# EasyEDA schematic SCH_Elektrisch Schema B_2022-11-22.json

## Sheets
1 Elektrisch schema B: TITLE: Linefillower; REV: 1.0; Date: 2022-10-09; Sheet: 1/1; Drawn By: Robbe Malfroot; Company: Hogent
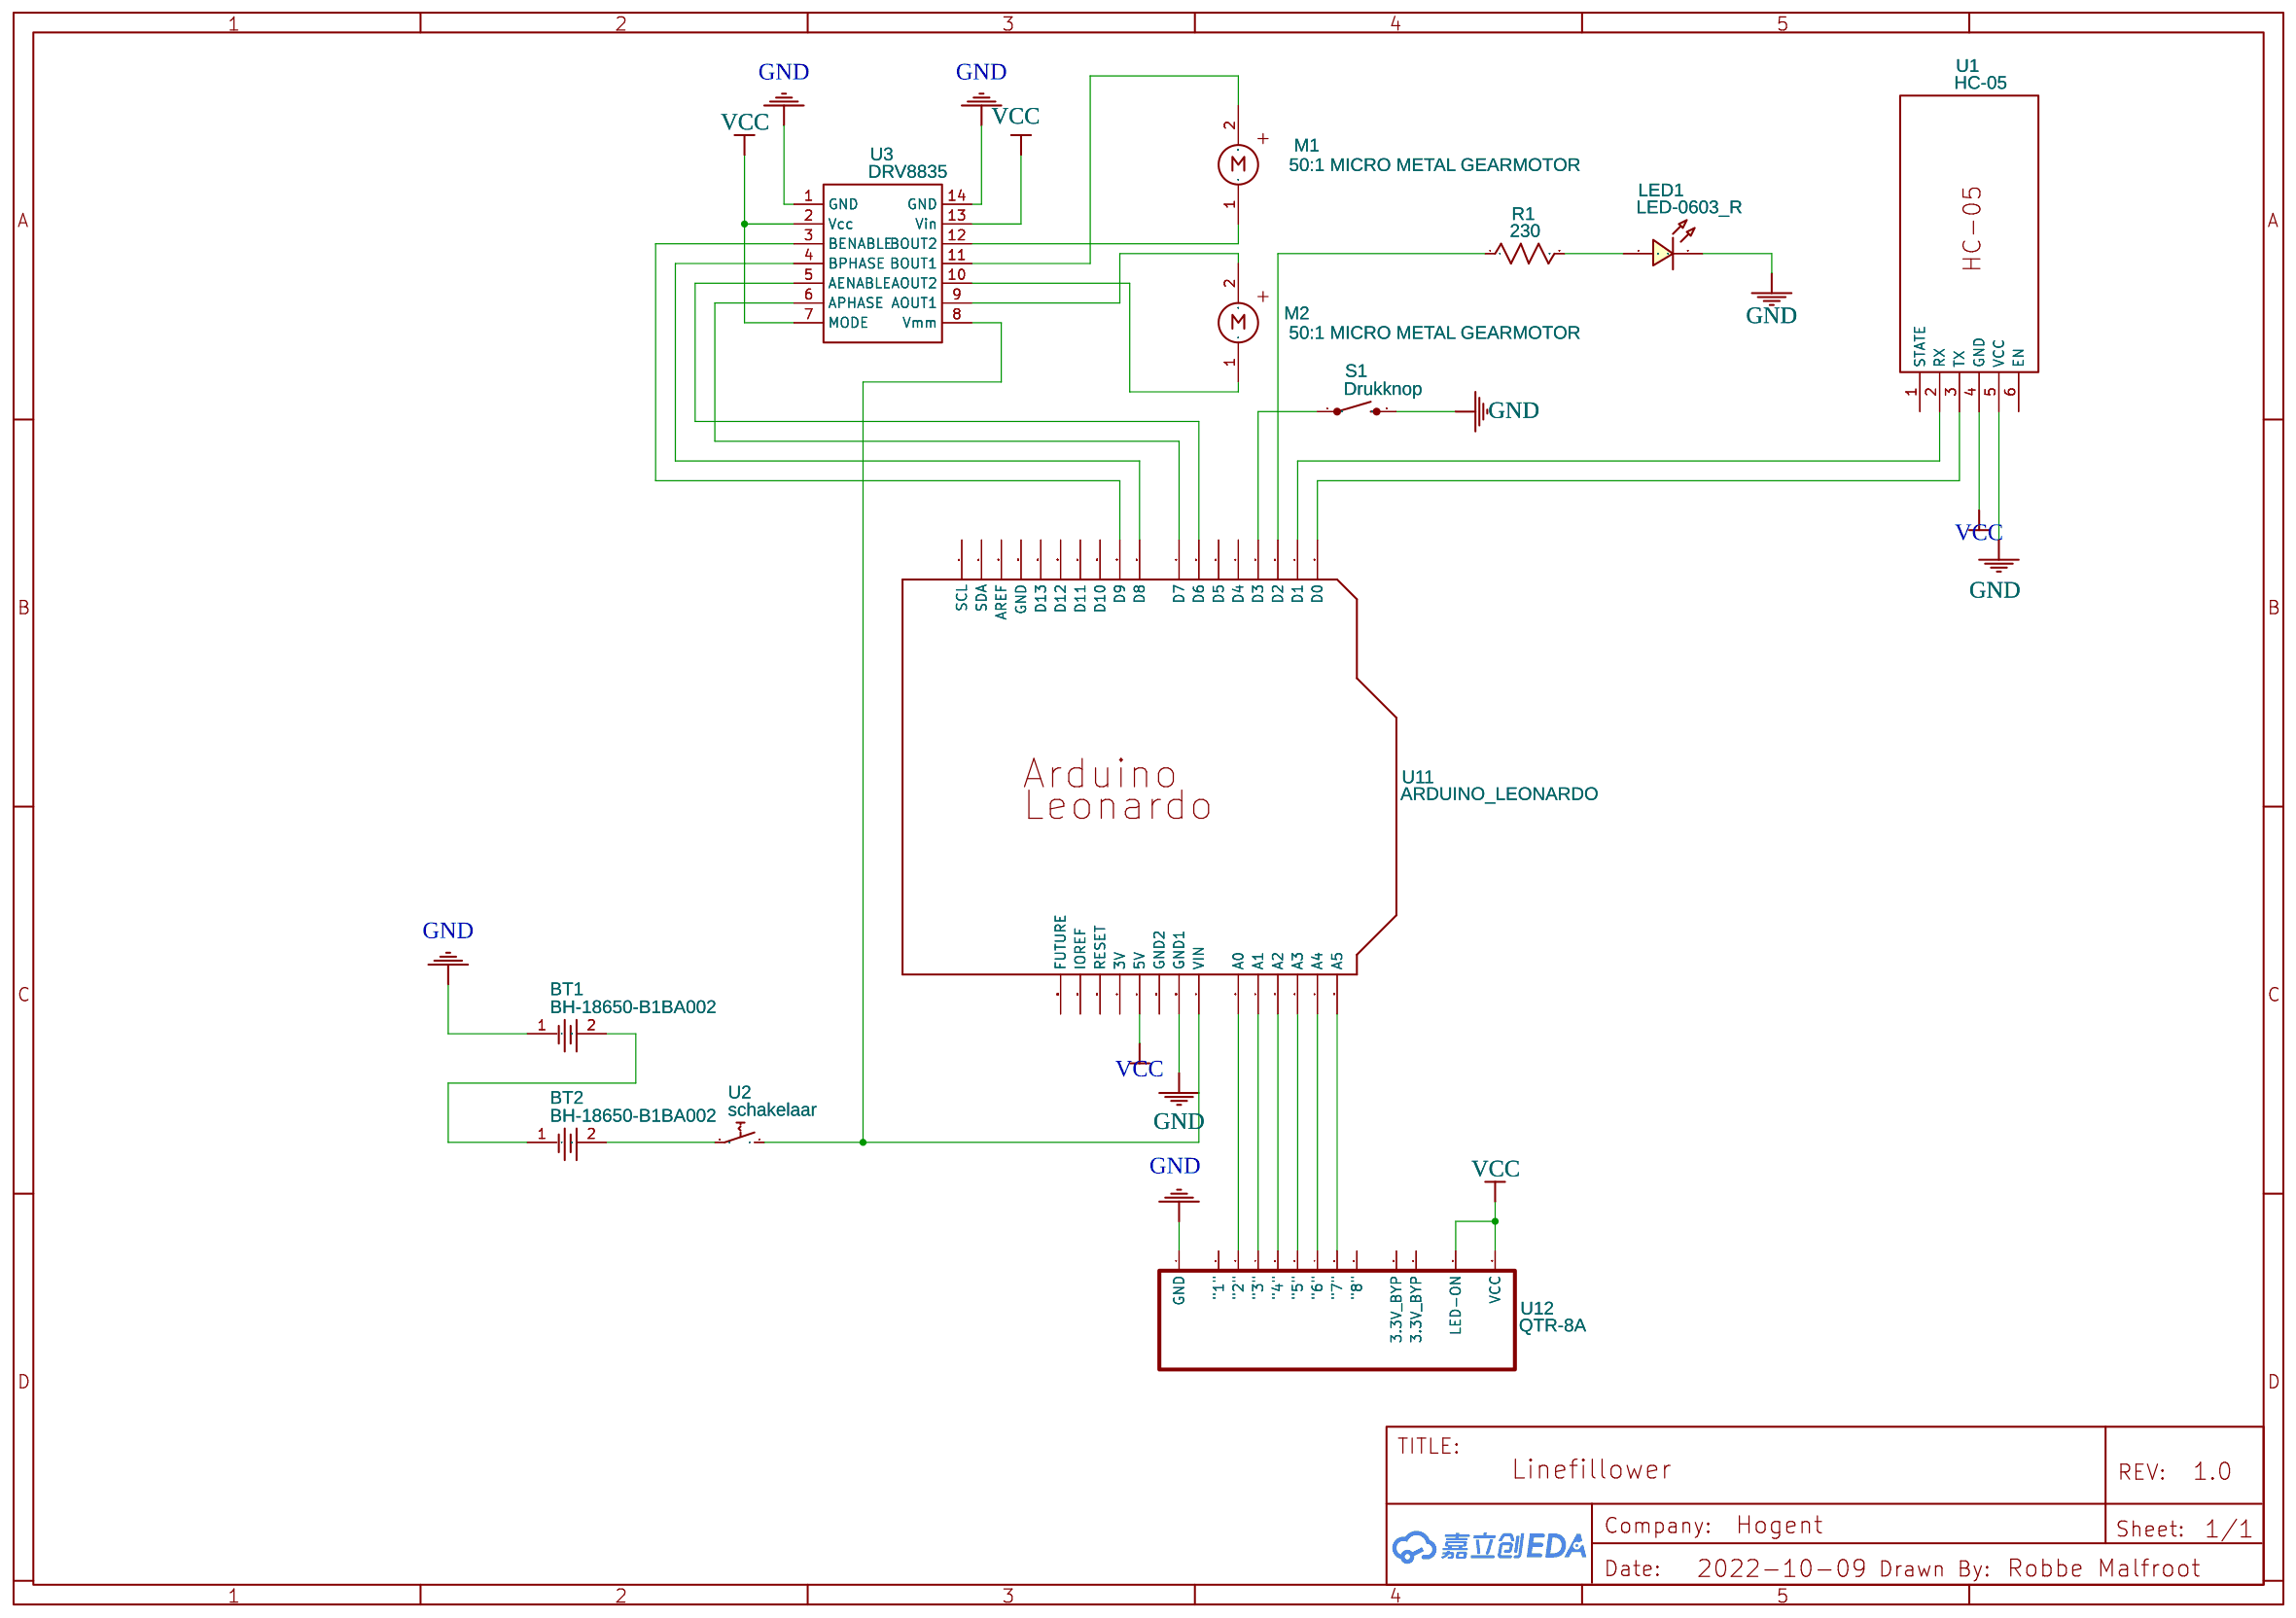
[diagram p0: Elektrisch schema B]
2 Communicatie_HC-05: TITLE: Communicatie HC-05; Date: 2022-10-22
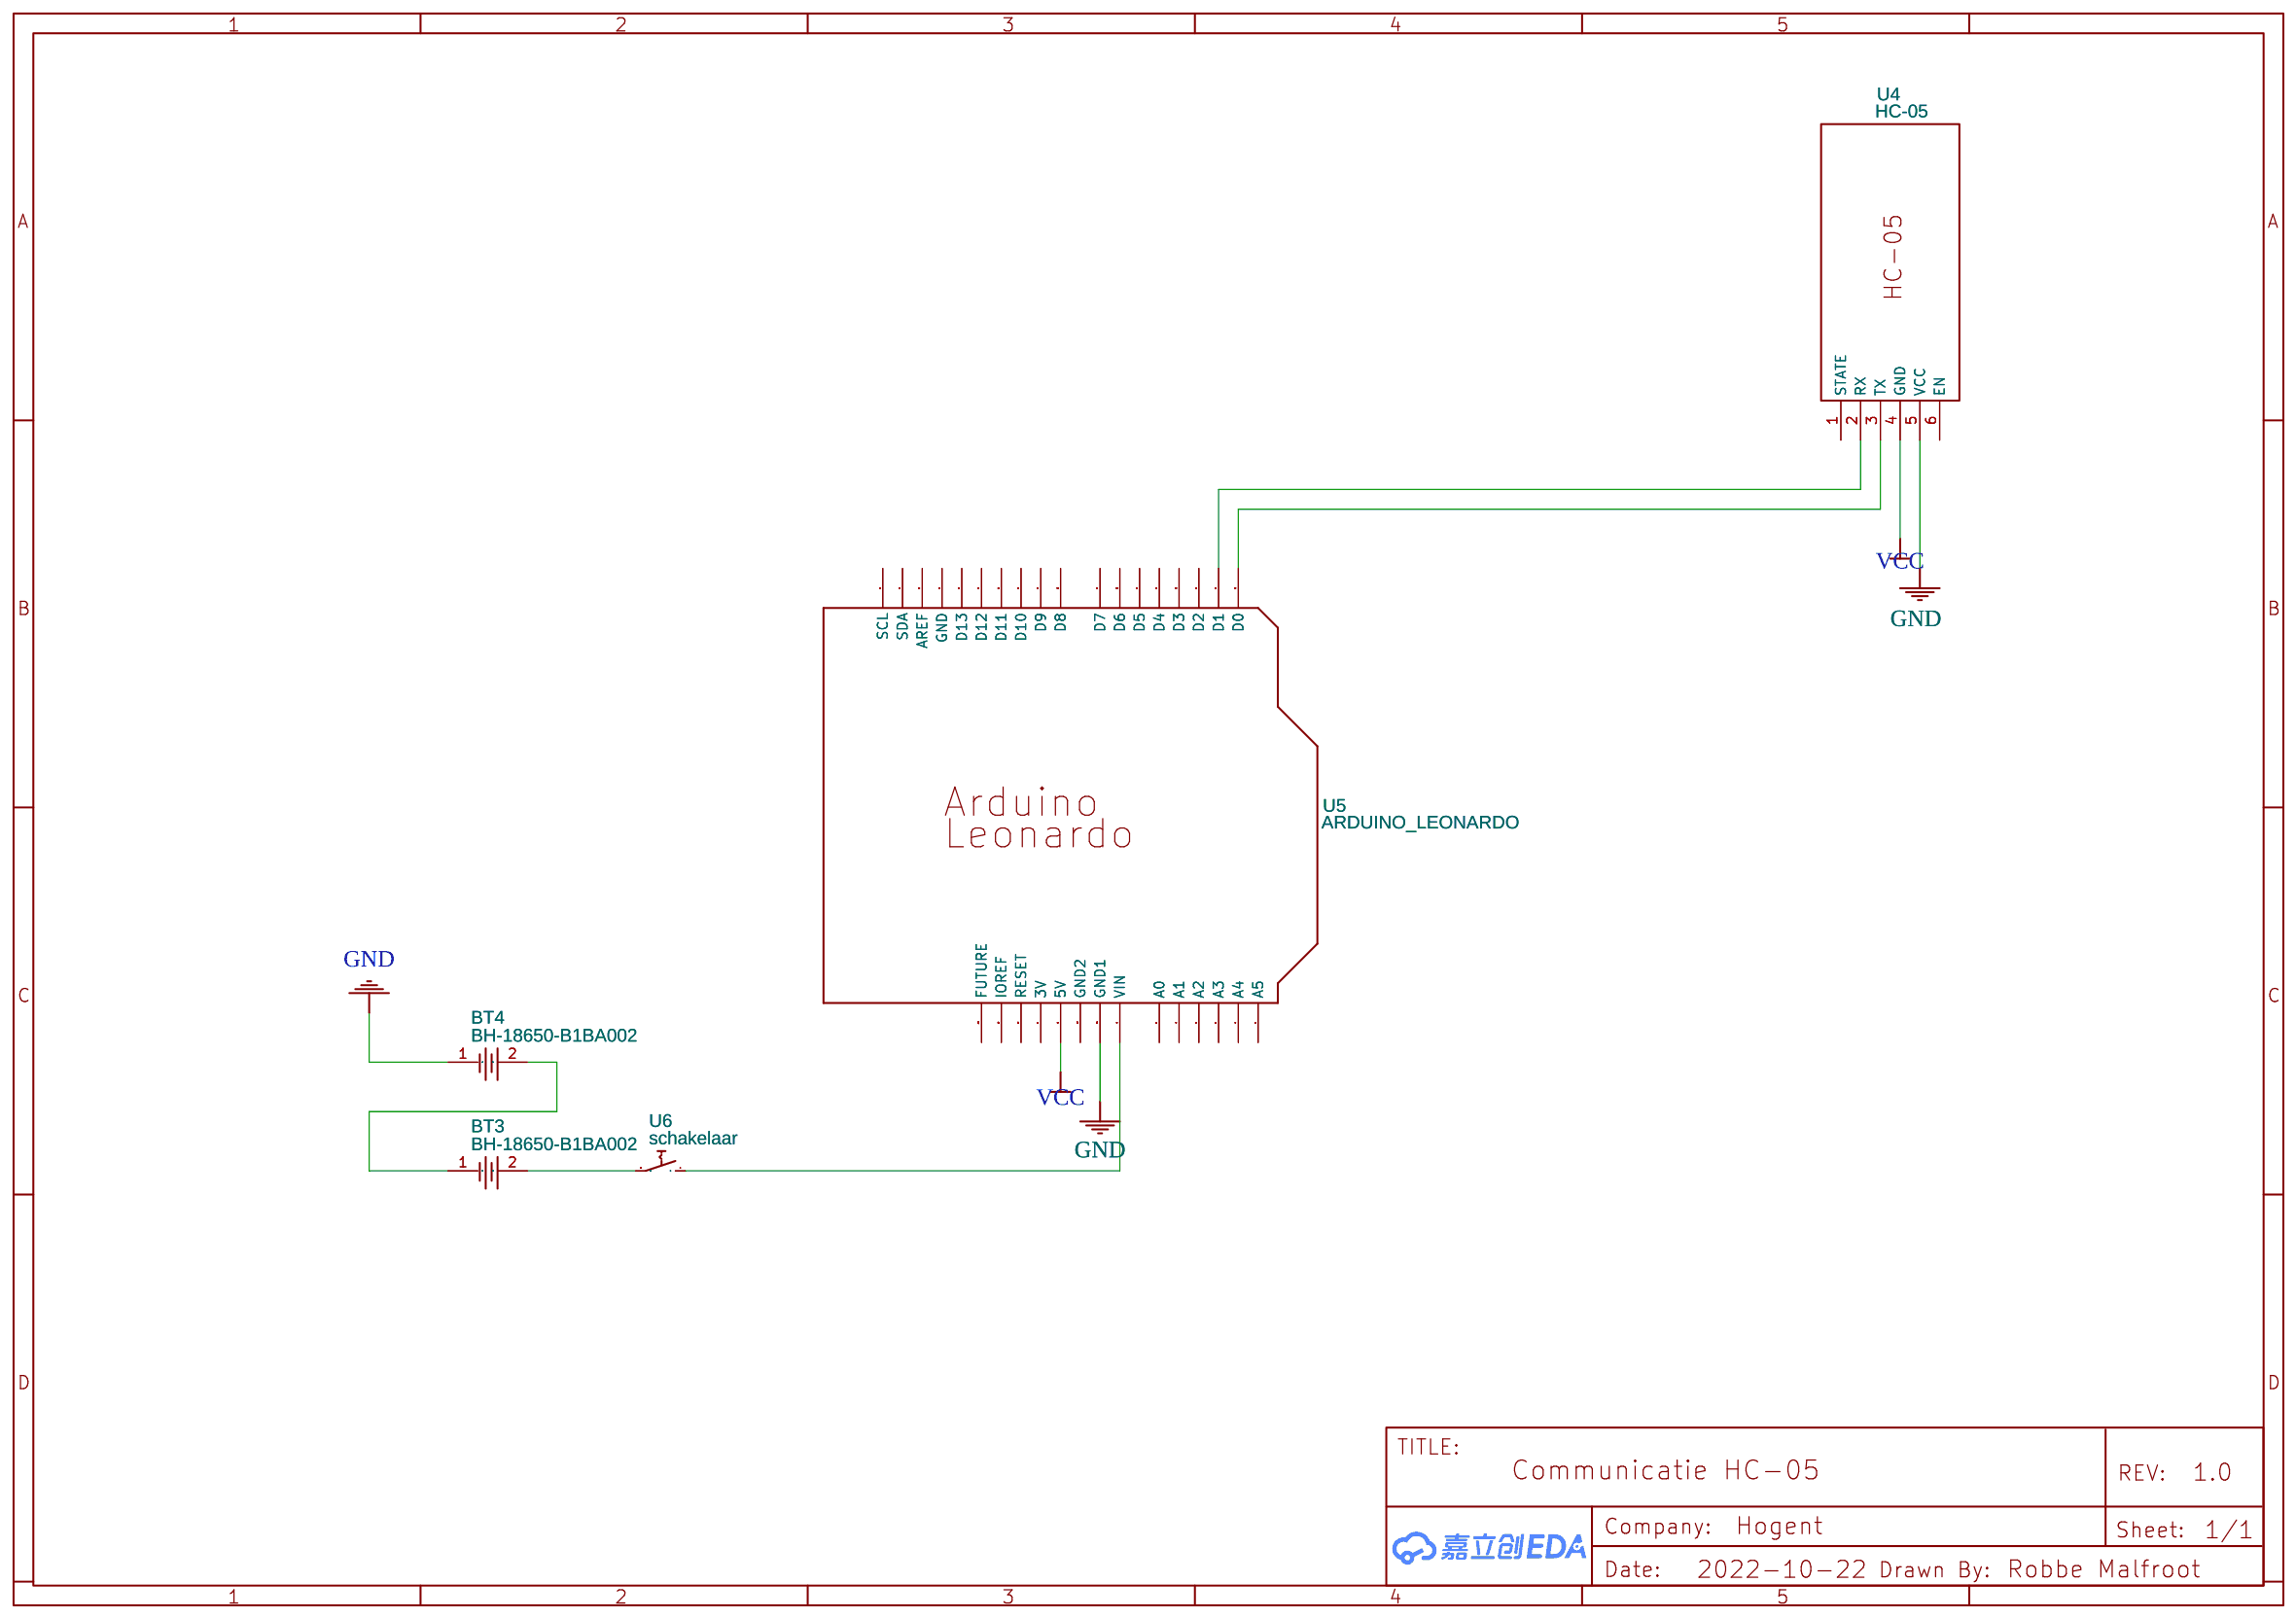
[diagram p1: Communicatie_HC-05]
3 QTR-8A: TITLE: Sensor QTR-8A; Date: 2022-10-22
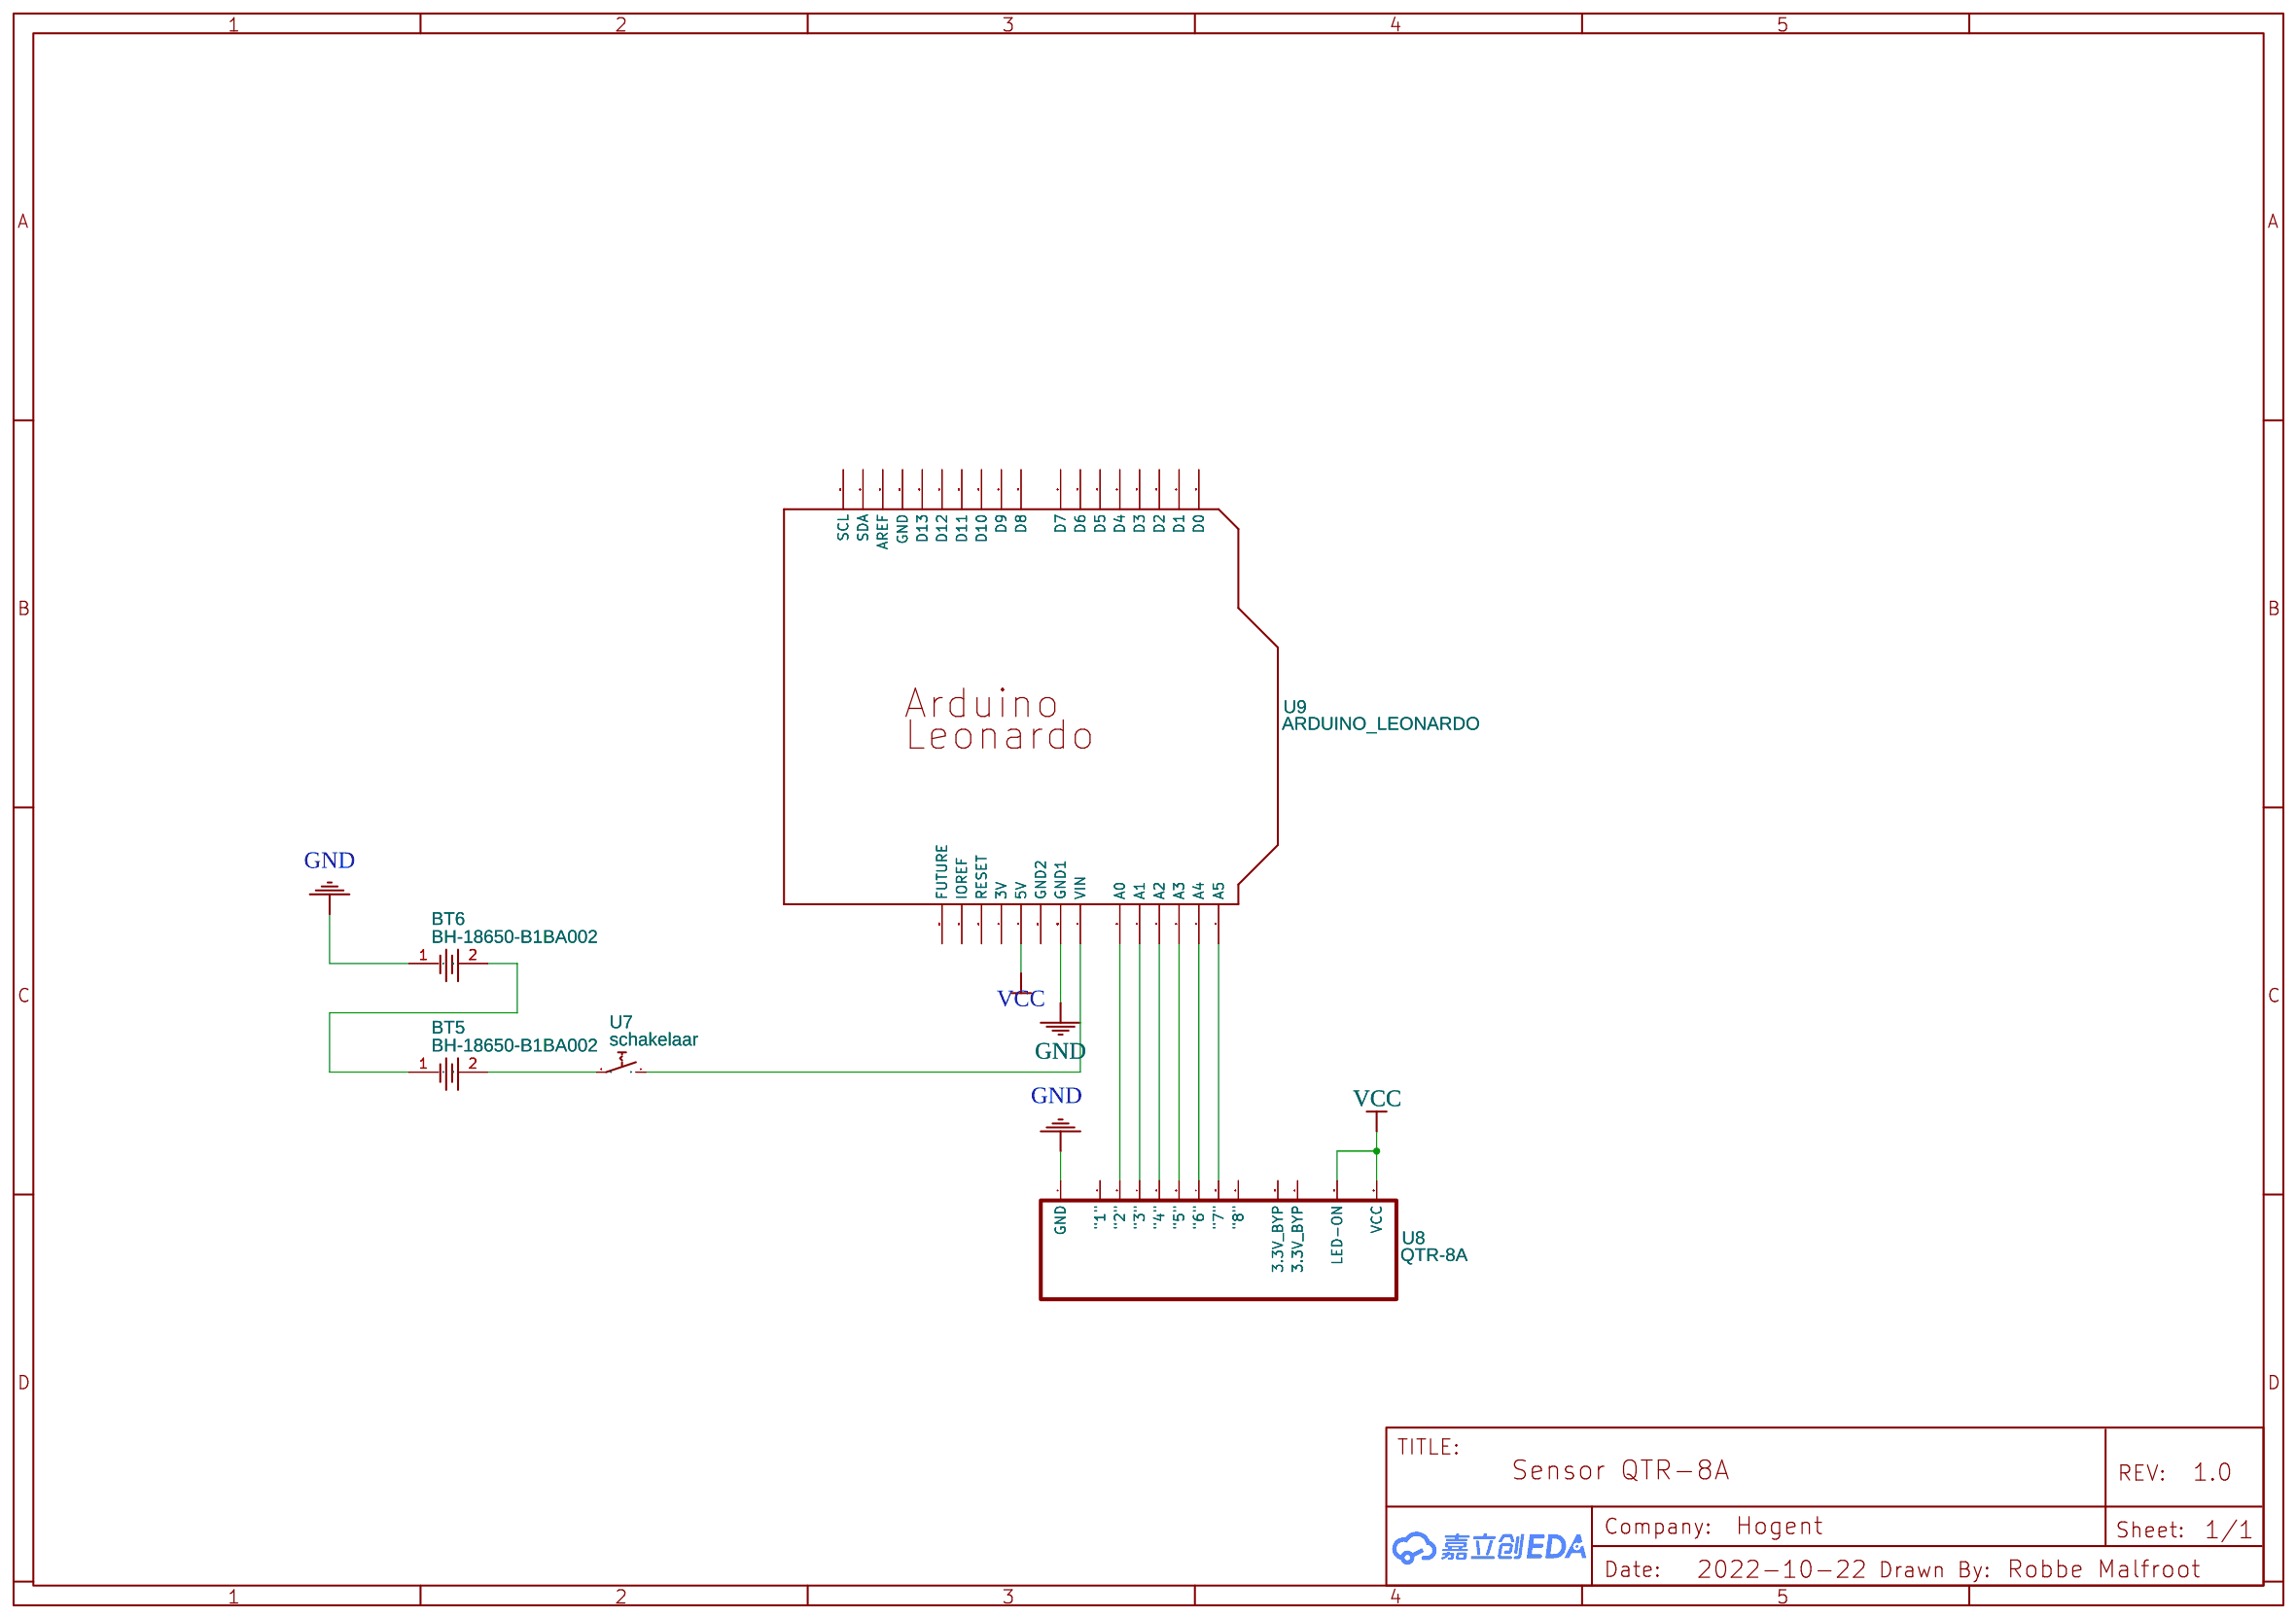
[diagram p2: QTR-8A]
4 H-brug DRV8835: TITLE: H-brug; Date: 2022-10-22
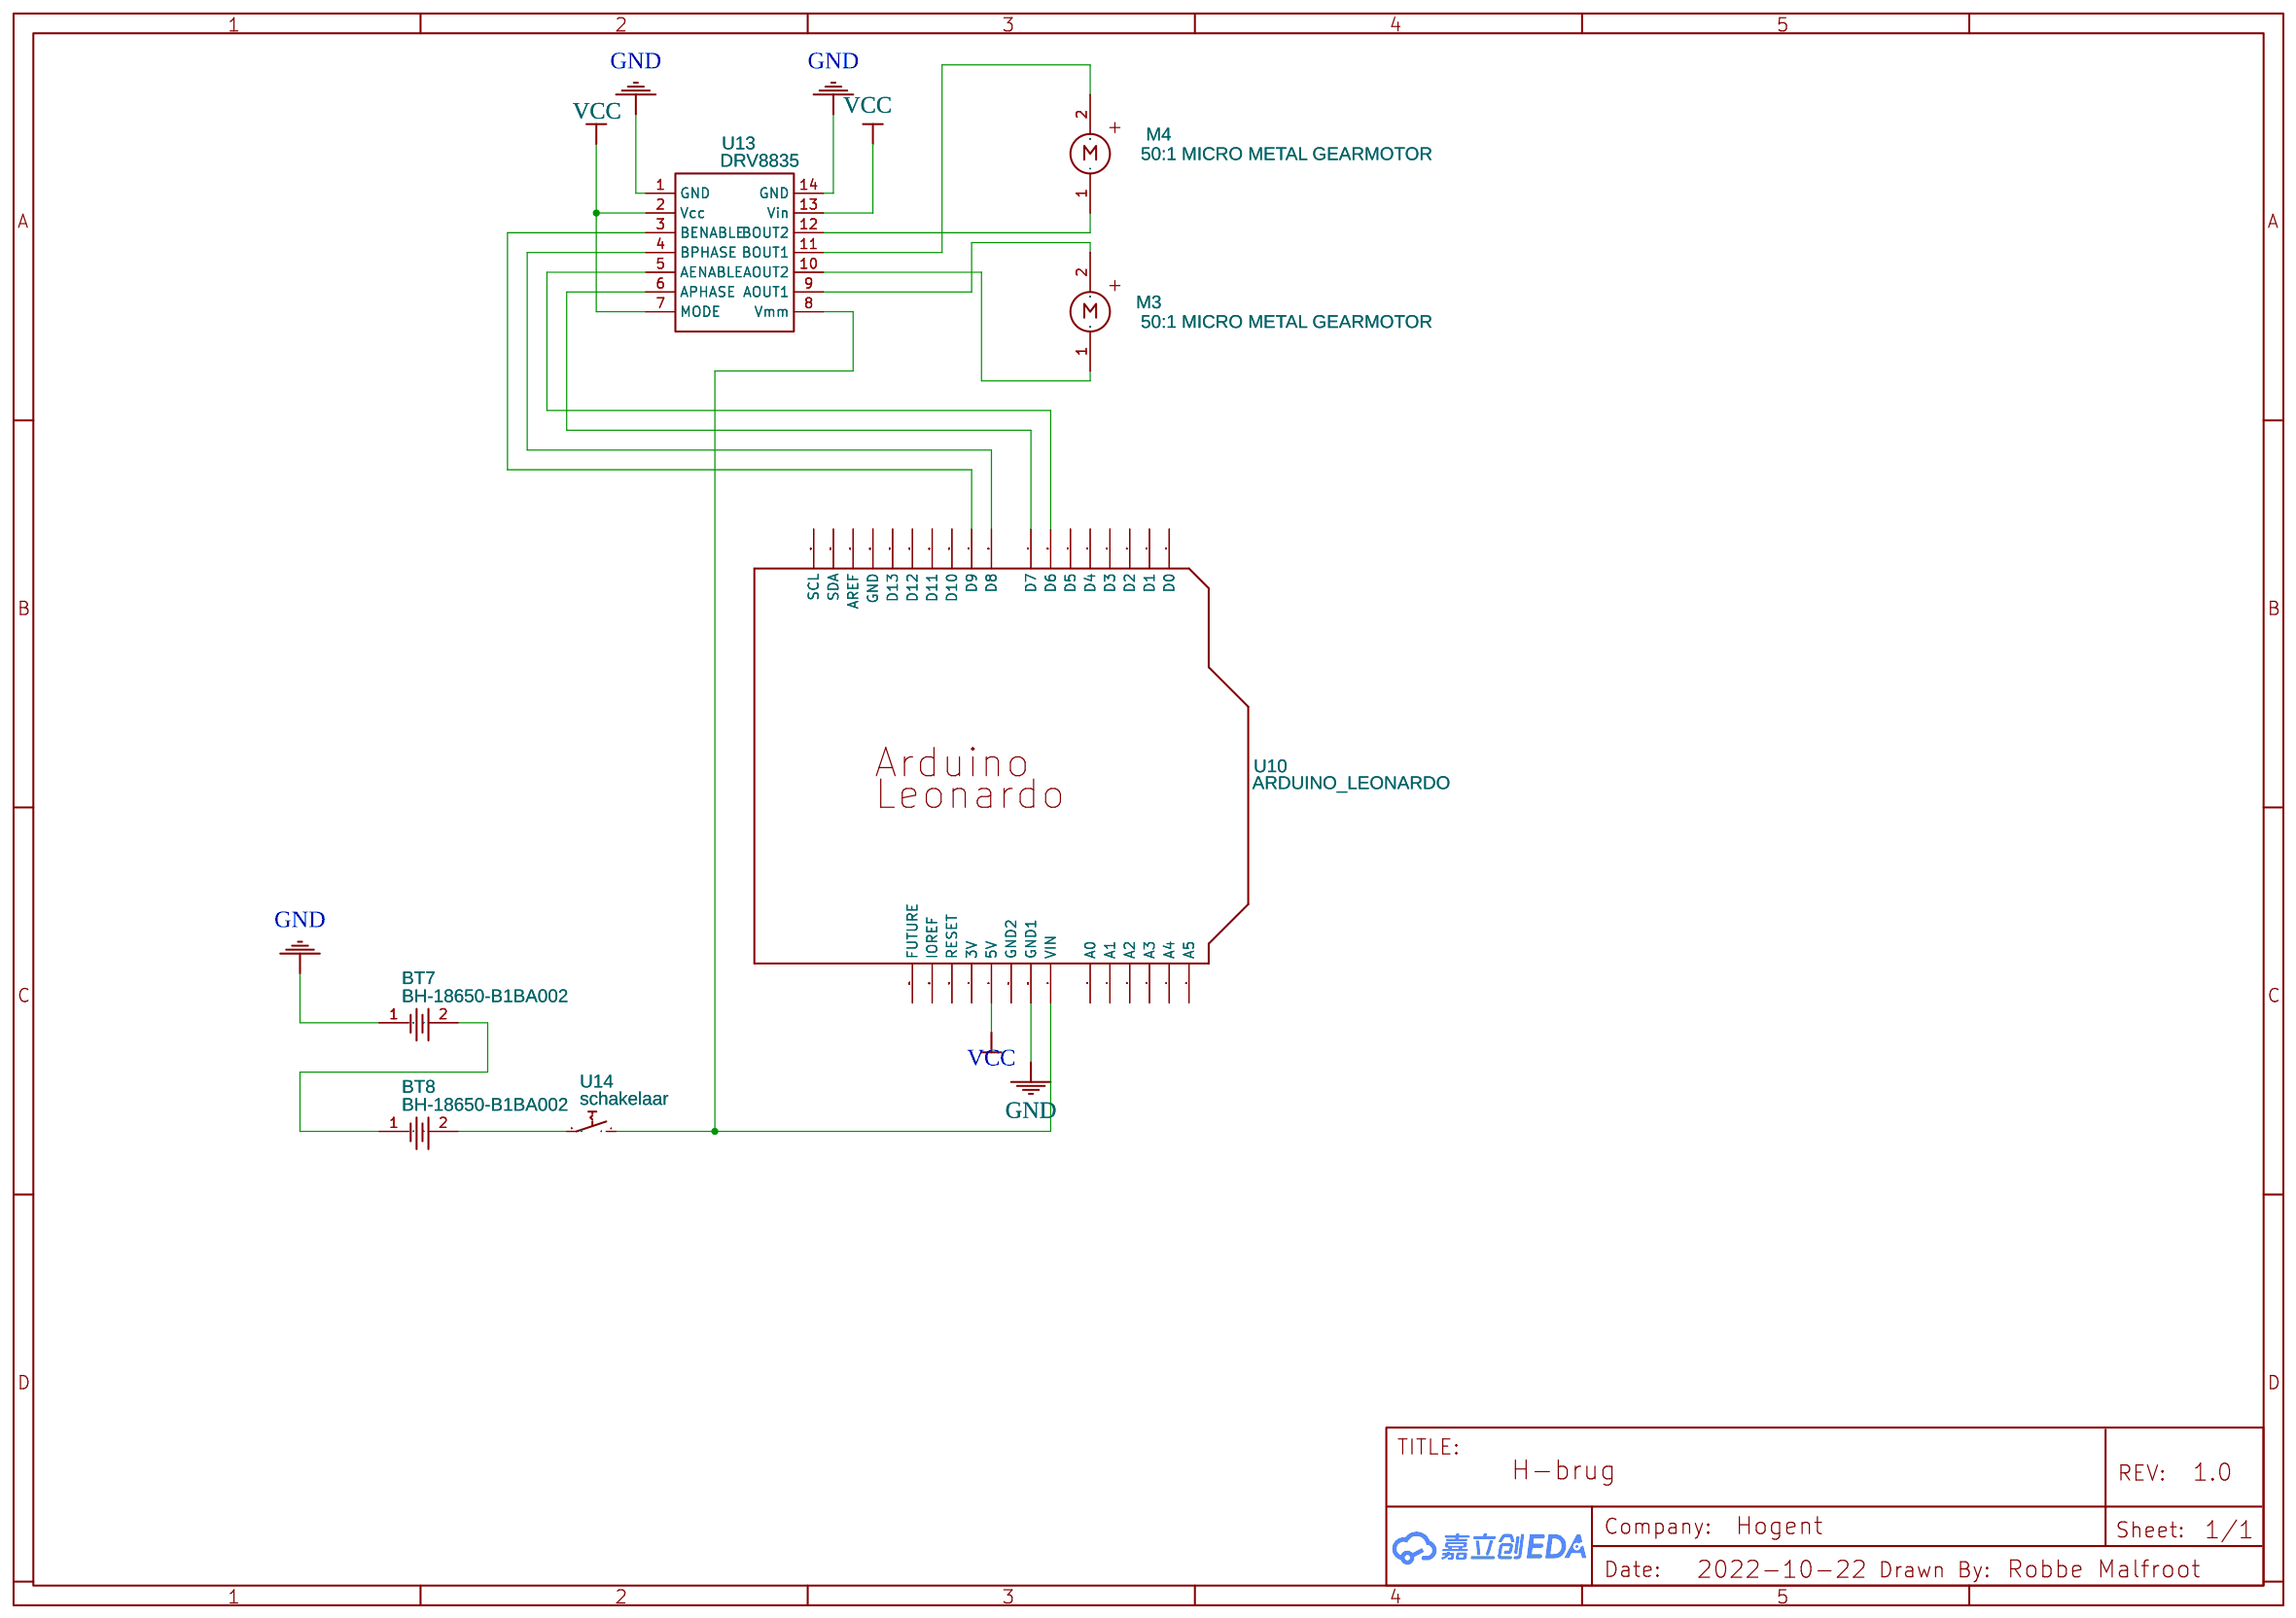
[diagram p3: H-brug DRV8835]

## Parts
sheet Communicatie_HC-05
BT3  BH-18650-B1BA002  [BATTERY-SMD_18650-1S-L77.1-W20.7-1]
BT4  BH-18650-B1BA002  [BATTERY-SMD_18650-1S-L77.1-W20.7-1]
U4  HC-05  [HM-10 LATEST]
U5  ARDUINO_LEONARDO  [ARDUINO_LEONARDO]
U6  schakelaar
sheet Elektrisch schema B
BT1  BH-18650-B1BA002  [BATTERY-SMD_18650-1S-L77.1-W20.7-1]
BT2  BH-18650-B1BA002  [BATTERY-SMD_18650-1S-L77.1-W20.7-1]
LED1  LED-0603_R  [LED0603_RED]
M1  50:1 MICRO METAL GEARMOTOR  [POLOLU-3071]
M2  50:1 MICRO METAL GEARMOTOR  [POLOLU-3071]
R1  230  [R0603]
S1  Drukknop  [DRUKKNOP-PCB]
U1  HC-05  [HM-10 LATEST]
U2  schakelaar
U3  DRV8835  [DRV8835]
U11  ARDUINO_LEONARDO  [ARDUINO_LEONARDO]
U12  QTR-8A  [QTR-8A/8RC]
sheet H-brug DRV8835
BT7  BH-18650-B1BA002  [BATTERY-SMD_18650-1S-L77.1-W20.7-1]
BT8  BH-18650-B1BA002  [BATTERY-SMD_18650-1S-L77.1-W20.7-1]
M3  50:1 MICRO METAL GEARMOTOR  [POLOLU-3071]
M4  50:1 MICRO METAL GEARMOTOR  [POLOLU-3071]
U10  ARDUINO_LEONARDO  [ARDUINO_LEONARDO]
U13  DRV8835  [DRV8835]
U14  schakelaar
sheet QTR-8A
BT5  BH-18650-B1BA002  [BATTERY-SMD_18650-1S-L77.1-W20.7-1]
BT6  BH-18650-B1BA002  [BATTERY-SMD_18650-1S-L77.1-W20.7-1]
U7  schakelaar
U8  QTR-8A  [QTR-8A/8RC]
U9  ARDUINO_LEONARDO  [ARDUINO_LEONARDO]

## Library data of the parts
BT1-BT8 = BH-18650-B1BA002: Supplier: LCSC; Supplier Part: C2988620; Manufacturer: MYOUNG(美阳); link: https://atta.szlcsc.com/upload/public/pdf/source/20220402/870DB99AB50CA0DF8D51CF7C86A51FAB.pdf; Contributor: lcsc; JLCPCB Part Class: Extended Part
U1 U4 = HM-10: Contributor: jmprice50
U5 U9-U11 = ARDUINO_LEONARDO
U2 U6 U7 U14 = schakelaar: Contributor: onschacline
LED1 = LED-0603_R: Manufacturer: EVERLIGHT(台湾亿光); Manufacturer Part: 19-217/R6C-AL1M2VY/3T; Supplier Part: C72044; Supplier: LCSC; Contributor: LCEDA_01
M1-M4 = 10:1 MICRO METAL GEARMOTOR eskere: Manufacturer: Pololu; Manufacturer Part: 10:1 Micro Metal Gearmotor HPCB 6V with Extended Motor Shaft; Supplier: Pololu; Supplier Part: 3071; link: https://www.pololu.com/product/3071; Contributor: cheght
R1 = R_0603_US: Contributor: LCEDA_Lib
S1 = Drukknop: Various NO switches- pushbuttons, reed, etc; Contributor: Dompie
U3 U13 = DRV8835: Contributor: Mustafa Mutlu
U8 U12 = QTR-8A: Manufacturer: Pololu; Supplier: Pololu; Supplier Part: 960; link: https://www.pololu.com/docs/pdf/0J12/QTR-8x.pdf; Contributor: Junikos

## Nets
GND: BT1.1 BT4.1 BT6.1 BT7.1 LED1.2 S1.2 U1.5(VCC) U3.1(GND) U3.14(GND) U4.5(VCC) U5.GND$3(GND1) U8.1(GND) U9.GND$3(GND1) U10.GND$3(GND1) U11.GND$3(GND1) U12.1(GND) U13.1(GND) U13.14(GND)
VCC: U1.4(GND) U3.2(Vcc) U3.7(MODE) U3.13(Vin) U4.4(GND) U5.5V U8.12(LED-ON) U9.5V U10.5V U11.5V U12.12(LED-ON) U13.2(Vcc) U13.7(MODE) U13.13(Vin)
Net-(BT1-2): BT1.2 BT2.1
Net-(BT2-2): BT2.2 U2.2
Net-(BT3-1): BT3.1 BT4.2
Net-(BT3-2): BT3.2 U6.2
Net-(BT5-1): BT5.1 BT6.2
Net-(BT5-2): BT5.2 U7.2
Net-(BT7-2): BT7.2 BT8.1
Net-(BT8-2): BT8.2 U14.2
Net-(LED1-1): LED1.1 R1.2
Net-(M1-1): M1.1 U3.12(BOUT2)
Net-(M1-2): M1.2 U3.11(BOUT1)
Net-(M2-1): M2.1 U3.10(AOUT2)
Net-(M2-2): M2.2 U3.9(AOUT1)
Net-(M3-1): M3.1 U13.10(AOUT2)
Net-(M3-2): M3.2 U13.9(AOUT1)
Net-(M4-1): M4.1 U13.12(BOUT2)
Net-(M4-2): M4.2 U13.11(BOUT1)
Net-(R1-1): R1.1 U11.D2
Net-(S1-1): S1.1 U11.D3
Net-(U1-2): U1.2(RX) U11.D1
Net-(U1-3): U1.3(TX) U11.D0
Net-(U2-1): U2.1 U3.8(Vmm) U11.VIN
Net-(U3-3): U3.3(BENABLE) U11.D9
Net-(U3-4): U3.4(BPHASE) U11.D8
Net-(U3-5): U3.5(AENABLE) U11.D6
Net-(U3-6): U3.6(APHASE) U11.D7
Net-(U4-2): U4.2(RX) U5.D1
Net-(U4-3): U4.3(TX) U5.D0
Net-(U5-VIN): U5.VIN U6.1
Net-(U7-1): U7.1 U9.VIN
Net-(U8-3): U8.3("2") U9.A0
Net-(U8-4): U8.4("3") U9.A1
Net-(U8-5): U8.5("4") U9.A2
Net-(U8-6): U8.6("5") U9.A3
Net-(U8-7): U8.7("6") U9.A4
Net-(U8-8): U8.8("7") U9.A5
Net-(U10-D6): U10.D6 U13.5(AENABLE)
Net-(U10-D7): U10.D7 U13.6(APHASE)
Net-(U10-D8): U10.D8 U13.4(BPHASE)
Net-(U10-D9): U10.D9 U13.3(BENABLE)
Net-(U10-VIN): U10.VIN U13.8(Vmm) U14.1
Net-(U11-A0): U11.A0 U12.3("2")
Net-(U11-A1): U11.A1 U12.4("3")
Net-(U11-A2): U11.A2 U12.5("4")
Net-(U11-A3): U11.A3 U12.6("5")
Net-(U11-A4): U11.A4 U12.7("6")
Net-(U11-A5): U11.A5 U12.8("7")

Not connected (* = marked no-connect by the designer): U1 1(STATE) 6(EN); U4 1(STATE) 6(EN); U5 3V A0 A1 A2 A3 A4 A5 AREF D2 D3 D4 D5 D6 D7 D8 D9 D10 D11 D12 D13 GND GND$2(GND2) IOREF RESERVED(FUTURE) RESET SCL SDA; U8 2("1") 9("8") 10(3.3V BYP) 11(3.3V BYP); U9 3V AREF D0 D1 D2 D3 D4 D5 D6 D7 D8 D9 D10 D11 D12 D13 GND GND$2(GND2) IOREF RESERVED(FUTURE) RESET SCL SDA; U10 3V A0 A1 A2 A3 A4 A5 AREF D0 D1 D2 D3 D4 D5 D10 D11 D12 D13 GND GND$2(GND2) IOREF RESERVED(FUTURE) RESET SCL SDA; U11 3V AREF D4 D5 D10 D11 D12 D13 GND GND$2(GND2) IOREF RESERVED(FUTURE) RESET SCL SDA; U12 2("1") 9("8") 10(3.3V BYP) 11(3.3V BYP)
